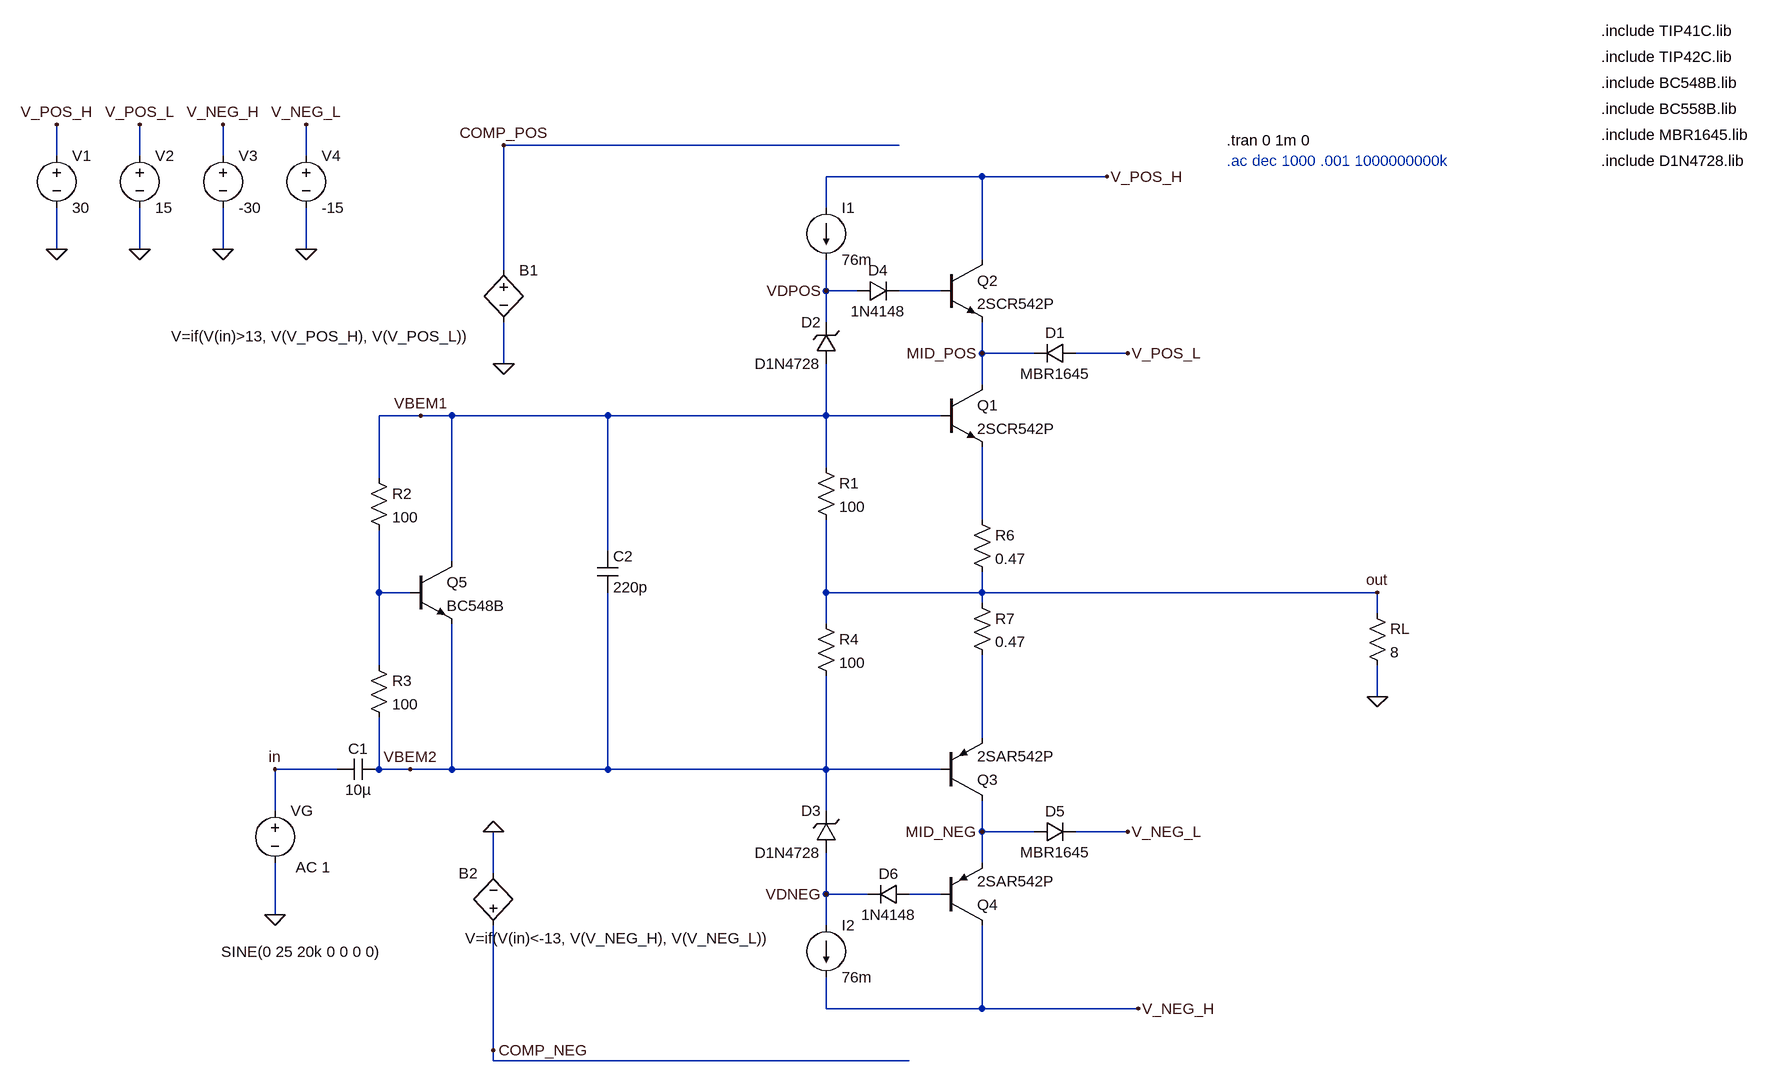
[diagram p0: schematic ClaseG_Basico_NPN_PNP_reales.asc]
ClaseG_Basico_NPN_PNP_reales.asc, the LTspice schematic file:
Version 4
SHEET 1 1656 1476
WIRE 336 -96 -272 -96
WIRE -960 -80 -960 -128
WIRE -832 -80 -832 -128
WIRE -704 -80 -704 -128
WIRE -576 -80 -576 -128
WIRE 464 -48 224 -48
WIRE 656 -48 464 -48
WIRE 224 0 224 -48
WIRE -960 64 -960 0
WIRE -832 64 -832 0
WIRE -704 64 -704 0
WIRE -576 64 -576 0
WIRE 464 80 464 -48
WIRE -272 96 -272 -96
WIRE 224 128 224 80
WIRE 272 128 224 128
WIRE 400 128 336 128
WIRE 224 176 224 128
WIRE 464 224 464 176
WIRE 544 224 464 224
WIRE 688 224 608 224
WIRE -272 240 -272 176
WIRE 464 272 464 224
WIRE -400 320 -464 320
WIRE -352 320 -400 320
WIRE -112 320 -352 320
WIRE 224 320 224 240
WIRE 224 320 -112 320
WIRE 400 320 224 320
WIRE 224 400 224 320
WIRE -464 416 -464 320
WIRE 464 480 464 368
WIRE -112 528 -112 320
WIRE -352 544 -352 320
WIRE -464 592 -464 496
WIRE -416 592 -464 592
WIRE 224 592 224 480
WIRE 464 592 464 560
WIRE 464 592 224 592
WIRE 1072 592 464 592
WIRE 464 608 464 592
WIRE 1072 624 1072 592
WIRE 224 640 224 592
WIRE -464 704 -464 592
WIRE 1072 752 1072 704
WIRE 464 816 464 688
WIRE -528 864 -624 864
WIRE -464 864 -464 784
WIRE -416 864 -464 864
WIRE -352 864 -352 640
WIRE -352 864 -416 864
WIRE -112 864 -112 592
WIRE -112 864 -352 864
WIRE 224 864 224 720
WIRE 224 864 -112 864
WIRE 400 864 224 864
WIRE -624 928 -624 864
WIRE 224 928 224 864
WIRE 464 960 464 912
WIRE 544 960 464 960
WIRE 688 960 608 960
WIRE 464 1008 464 960
WIRE -288 1024 -288 960
WIRE 224 1056 224 992
WIRE 288 1056 224 1056
WIRE 400 1056 352 1056
WIRE -624 1088 -624 1008
WIRE 224 1104 224 1056
WIRE 224 1232 224 1184
WIRE 464 1232 464 1104
WIRE 464 1232 224 1232
WIRE 704 1232 464 1232
WIRE -288 1296 -288 1104
WIRE -288 1312 -288 1296
WIRE 352 1312 -288 1312
FLAG -624 1088 0
FLAG 1072 752 0
FLAG -400 320 VBEM1
FLAG -416 864 VBEM2
FLAG -960 64 0
FLAG -832 64 0
FLAG -960 -128 V_POS_H
FLAG -832 -128 V_POS_L
FLAG 656 -48 V_POS_H
FLAG -704 64 0
FLAG -576 64 0
FLAG -704 -128 V_NEG_H
FLAG -576 -128 V_NEG_L
FLAG 688 224 V_POS_L
FLAG 704 1232 V_NEG_H
FLAG 688 960 V_NEG_L
FLAG 1072 592 out
FLAG 224 128 VDPOS
FLAG 224 1056 VDNEG
FLAG -272 240 0
FLAG -272 -96 COMP_POS
FLAG -624 864 in
FLAG 464 224 MID_POS
FLAG 464 960 MID_NEG
FLAG -288 960 0
FLAG -288 1296 COMP_NEG
DATAFLAG 944 592 ""
DATAFLAG 464 432 "Ie(Q1)"
DATAFLAG 464 752 "Ie(Q3)"
DATAFLAG 48 576 "V(vbem1)-V(vbem2)"
DATAFLAG -272 320 ""
DATAFLAG -256 864 ""
DATAFLAG 32 224 "V(VDPOS)-V(vbem1)"
DATAFLAG 48 960 "V(vbem2)-V(VDNEG)"
SYMBOL npn 400 272 R0
SYMATTR InstName Q1
SYMATTR Value 2SCR542P
SYMBOL npn 400 80 R0
SYMATTR InstName Q2
SYMATTR Value 2SCR542P
SYMBOL diode 608 208 R90
WINDOW 0 0 32 VBottom 2
WINDOW 3 32 32 VTop 2
SYMATTR InstName D1
SYMATTR Value MBR1645
SYMBOL voltage -624 912 R0
WINDOW 3 -83 233 Left 2
WINDOW 123 32 103 Left 2
WINDOW 39 0 0 Left 0
SYMATTR Value SINE(0 25 20k 0 0 0 0)
SYMATTR Value2 AC 1
SYMATTR InstName VG
SYMBOL res 1056 608 R0
SYMATTR InstName RL
SYMATTR Value 8
SYMBOL current 224 0 R0
SYMATTR InstName I1
SYMATTR Value 76m
SYMBOL diode 544 944 M90
WINDOW 0 0 32 VBottom 2
WINDOW 3 32 32 VTop 2
SYMATTR InstName D5
SYMATTR Value MBR1645
SYMBOL pnp 400 912 M180
SYMATTR InstName Q3
SYMATTR Value 2SAR542P
SYMBOL pnp 400 1104 M180
SYMATTR InstName Q4
SYMATTR Value 2SAR542P
SYMBOL cap -464 848 R90
WINDOW 0 0 32 VBottom 2
WINDOW 3 32 32 VTop 2
SYMATTR InstName C1
SYMATTR Value 10µ
SYMBOL res 448 464 R0
SYMATTR InstName R6
SYMATTR Value 0.47
SYMBOL res 448 592 R0
SYMATTR InstName R7
SYMATTR Value 0.47
SYMBOL npn -416 544 R0
SYMATTR InstName Q5
SYMATTR Value BC548B
SYMBOL res -480 400 R0
SYMATTR InstName R2
SYMATTR Value 100
SYMBOL res -480 688 R0
SYMATTR InstName R3
SYMATTR Value 100
SYMBOL current 224 1104 R0
SYMATTR InstName I2
SYMATTR Value 76m
SYMBOL zener 240 992 R180
WINDOW 0 24 64 Left 2
WINDOW 3 24 0 Left 2
SYMATTR InstName D3
SYMATTR Value D1N4728
SYMBOL cap -128 528 R0
SYMATTR InstName C2
SYMATTR Value 220p
SYMBOL voltage -960 -96 R0
SYMATTR InstName V1
SYMATTR Value 30
SYMBOL voltage -832 -96 R0
SYMATTR InstName V2
SYMATTR Value 15
SYMBOL voltage -704 -96 R0
SYMATTR InstName V3
SYMATTR Value -30
SYMBOL voltage -576 -96 R0
SYMATTR InstName V4
SYMATTR Value -15
SYMBOL res 208 384 R0
SYMATTR InstName R1
SYMATTR Value 100
SYMBOL res 208 624 R0
SYMATTR InstName R4
SYMATTR Value 100
SYMBOL bv -272 80 R0
WINDOW 3 -512 118 Left 2
SYMATTR Value V=if(V(in)>13, V(V_POS_H), V(V_POS_L))
SYMATTR InstName B1
SYMBOL bv -288 1120 R180
WINDOW 3 -427 -4 Left 2
WINDOW 0 24 96 Left 2
SYMATTR Value V=if(V(in)<-13, V(V_NEG_H), V(V_NEG_L))
SYMATTR InstName B2
SYMBOL zener 240 240 R180
WINDOW 0 24 64 Left 2
WINDOW 3 24 0 Left 2
SYMATTR InstName D2
SYMATTR Value D1N4728
SYMBOL diode 272 144 R270
WINDOW 0 32 32 VTop 2
WINDOW 3 0 32 VBottom 2
SYMATTR InstName D4
SYMATTR Value 1N4148
SYMBOL diode 352 1040 R90
WINDOW 0 0 32 VBottom 2
WINDOW 3 32 32 VTop 2
SYMATTR InstName D6
SYMATTR Value 1N4148
TEXT 840 -104 Left 2 !.tran 0 1m 0
TEXT 840 -72 Left 2 ;.ac dec 1000 .001 1000000000k
TEXT 1416 -272 Left 2 !.include TIP41C.lib
TEXT 1416 -232 Left 2 !.include TIP42C.lib
TEXT 1416 -192 Left 2 !.include BC548B.lib
TEXT 1416 -112 Left 2 !.include MBR1645.lib
TEXT 1416 -152 Left 2 !.include BC558B.lib
TEXT 1416 -72 Left 2 !.include D1N4728.lib

The netlist it stands for:
* ClaseG_Basico_NPN_PNP_reales.asc
Q1 MID_POS VBEM1 N002 0 2SCR542P
Q2 V_POS_H N001 MID_POS 0 2SCR542P
D1 V_POS_L MID_POS MBR1645
VG in 0 SINE(0 25 20k 0 0 0 0) AC 1
RL out 0 8
I1 V_POS_H VDPOS 76m
D5 MID_NEG V_NEG_L MBR1645
Q3 MID_NEG VBEM2 N004 0 2SAR542P
Q4 V_NEG_H N005 MID_NEG 0 2SAR542P
C1 VBEM2 in 10µ
R6 N002 out 0.47
R7 out N004 0.47
Q5 VBEM1 N003 VBEM2 0 BC548B
R2 VBEM1 N003 100
R3 N003 VBEM2 100
I2 VDNEG V_NEG_H 76m
D3 VDNEG VBEM2 D1N4728
C2 VBEM1 VBEM2 220p
V1 V_POS_H 0 30
V2 V_POS_L 0 15
V3 V_NEG_H 0 -30
V4 V_NEG_L 0 -15
R1 VBEM1 out 100
R4 out VBEM2 100
B1 COMP_POS 0 V=if(V(in)>13, V(V_POS_H), V(V_POS_L))
B2 COMP_NEG 0 V=if(V(in)<-13, V(V_NEG_H), V(V_NEG_L))
D2 VBEM1 VDPOS D1N4728
D4 VDPOS N001 1N4148
D6 N005 VDNEG 1N4148
.model D D
.lib standard.dio
.model NPN NPN
.model PNP PNP
.lib standard.bjt
.tran 0 1m 0
* .ac dec 1000 .001 1000000000k
.include TIP41C.lib
.include TIP42C.lib
.include BC548B.lib
.include MBR1645.lib
.include BC558B.lib
.include D1N4728.lib
.backanno
.end